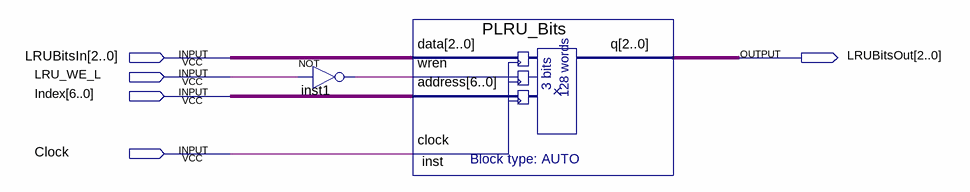
[diagram p0: schematic sheet]
// Quartus schematic PseudoLRU_Bits.bdf as structural Verilog: 2 symbols, 5 pins
module PseudoLRU_Bits (
  input  [2:0] LRUBitsIn,
  input  LRU_WE_L,
  input  [6:0] Index,
  input  Clock,
  output [2:0] LRUBitsOut
);

  wire inst1_out;

  not inst1 (inst1_out, LRU_WE_L);
  PLRU_Bits inst (.data(LRUBitsIn), .wren(inst1_out), .address(Index), .clock(Clock), .q(LRUBitsOut));
endmodule
